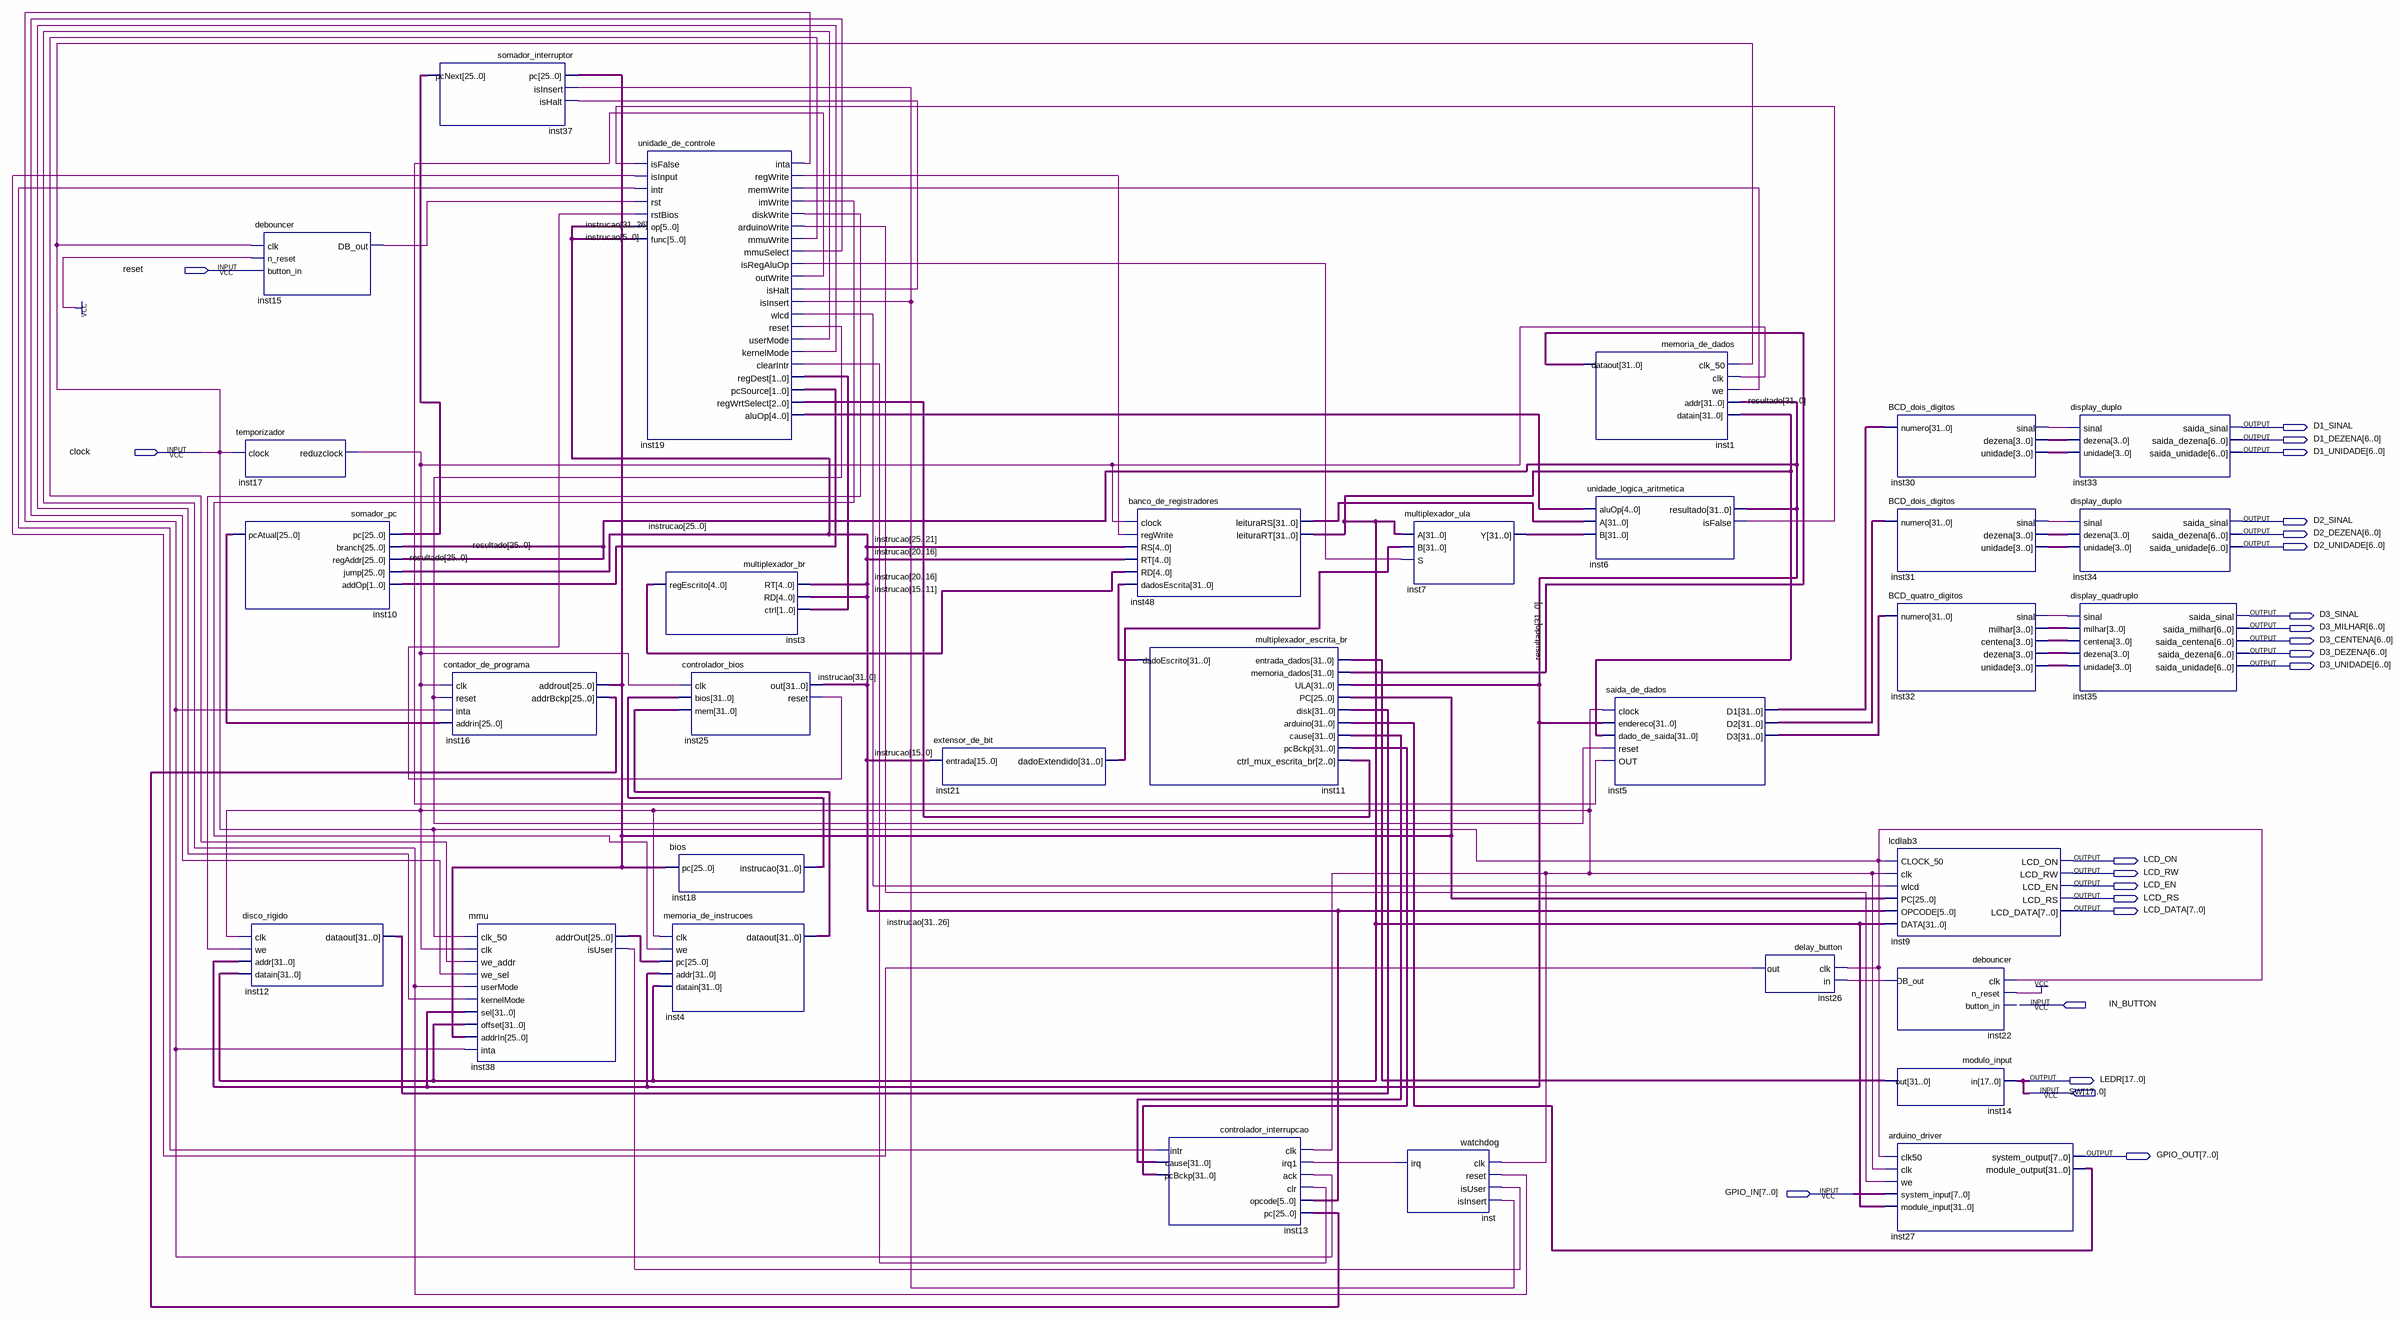
[diagram p0: schematic sheet]
// Quartus schematic iZero.bdf as structural Verilog: 32 symbols, 23 pins
module iZero (
  input  reset,
  input  clock,
  input  IN_BUTTON,
  input  [17:0] SW,
  input  [7:0] GPIO_IN,
  output D1_SINAL,
  output [6:0] D1_DEZENA,
  output [6:0] D1_UNIDADE,
  output D2_SINAL,
  output [6:0] D2_DEZENA,
  output [6:0] D2_UNIDADE,
  output D3_SINAL,
  output [6:0] D3_MILHAR,
  output [6:0] D3_CENTENA,
  output [6:0] D3_DEZENA,
  output [6:0] D3_UNIDADE,
  output LCD_ON,
  output LCD_RW,
  output LCD_EN,
  output LCD_RS,
  output [7:0] LCD_DATA,
  output [17:0] LEDR,
  output [7:0] GPIO_OUT
);

  wire inst6_isfalse, inst13_intr, inst15_db_out, inst17_reduzclock, inst19_arduinowrite, inst19_clearintr,
       inst19_diskwrite, inst19_imwrite, inst19_inta, inst19_ishalt, inst19_isinsert, inst19_isregaluop,
       inst19_kernelmode, inst19_memwrite, inst19_mmuselect, inst19_mmuwrite, inst19_outwrite,
       inst19_regwrite, inst19_reset, inst19_usermode, inst19_wlcd, inst22_db_out, inst25_reset, inst26_out,
       inst30_sinal, inst31_sinal, inst32_sinal, inst38_isuser, inst_irq;
  wire [1:0] inst19_pcsource, inst19_regdest;
  wire [2:0] inst19_regwrtselect;
  wire [3:0] inst30_dezena, inst30_unidade, inst31_dezena, inst31_unidade, inst32_centena, inst32_dezena,
       inst32_milhar, inst32_unidade;
  wire [4:0] inst3_regescrito, inst19_aluop;
  wire [25:0] inst10_pcatual, inst16_addrbckp, inst16_addrout, inst37_pcnext, inst38_addrout;
  wire [31:0] inst1_dataout, inst4_dataout, inst5_d1, inst5_d2, inst5_d3, inst7_y, inst11_dadoescrito,
       inst12_dataout, inst13_cause, inst13_pcbckp, inst14_out, inst18_instrucao, inst21_dadoextendido,
       inst27_module_output, inst48_leiturars, inst48_leiturart, instrucao, resultado;

  debouncer inst15 (.clk(clock), .n_reset(1'b1), .button_in(reset), .DB_out(inst15_db_out));
  temporizador inst17 (.clock(clock), .reduzclock(inst17_reduzclock));
  somador_pc inst10 (
    .pc(inst37_pcnext), .branch(resultado[25:0]), .regAddr(resultado[25:0]), .jump(instrucao[25:0]),
    .addOp(inst19_pcsource), .pcAtual(inst10_pcatual));
  disco_rigido inst12 (
    .clk(inst17_reduzclock), .we(inst19_diskwrite), .addr(resultado), .datain(inst48_leiturart),
    .dataout(inst12_dataout));
  somador_interruptor inst37 (
    .pc(inst16_addrout), .isInsert(inst19_isinsert), .isHalt(inst19_ishalt), .pcNext(inst37_pcnext));
  contador_de_programa inst16 (
    .clk(inst17_reduzclock), .reset(inst19_reset), .inta(inst19_inta), .addrin(inst10_pcatual),
    .addrout(inst16_addrout), .addrBckp(inst16_addrbckp));
  mmu inst38 (
    .clk_50(clock), .clk(inst17_reduzclock), .we_addr(inst19_mmuwrite), .we_sel(inst19_mmuselect),
    .userMode(inst19_usermode), .kernelMode(inst19_kernelmode), .sel(resultado), .offset(inst48_leiturart),
    .addrIn(inst16_addrout), .inta(inst19_inta), .addrOut(inst38_addrout), .isUser(inst38_isuser));
  unidade_de_controle inst19 (
    .isFalse(inst6_isfalse), .isInput(inst26_out), .intr(inst13_intr), .rst(inst15_db_out),
    .rstBios(inst25_reset), .op(instrucao[31:26]), .func(instrucao[5:0]), .inta(inst19_inta),
    .regWrite(inst19_regwrite), .memWrite(inst19_memwrite), .imWrite(inst19_imwrite),
    .diskWrite(inst19_diskwrite), .arduinoWrite(inst19_arduinowrite), .mmuWrite(inst19_mmuwrite),
    .mmuSelect(inst19_mmuselect), .isRegAluOp(inst19_isregaluop), .outWrite(inst19_outwrite),
    .isHalt(inst19_ishalt), .isInsert(inst19_isinsert), .wlcd(inst19_wlcd), .reset(inst19_reset),
    .userMode(inst19_usermode), .kernelMode(inst19_kernelmode), .clearIntr(inst19_clearintr),
    .regDest(inst19_regdest), .pcSource(inst19_pcsource), .regWrtSelect(inst19_regwrtselect),
    .aluOp(inst19_aluop));
  multiplexador_br inst3 (
    .RT(instrucao[20:16]), .RD(instrucao[15:11]), .ctrl(inst19_regdest), .regEscrito(inst3_regescrito));
  controlador_bios inst25 (
    .clk(inst17_reduzclock), .bios(inst18_instrucao), .mem(inst4_dataout), .out(instrucao),
    .reset(inst25_reset));
  bios inst18 (.pc(inst16_addrout), .instrucao(inst18_instrucao));
  memoria_de_instrucoes inst4 (
    .clk(inst17_reduzclock), .we(inst19_imwrite), .pc(inst38_addrout), .addr(resultado),
    .datain(inst48_leiturart), .dataout(inst4_dataout));
  extensor_de_bit inst21 (.entrada(instrucao[15:0]), .dadoExtendido(inst21_dadoextendido));
  banco_de_registradores inst48 (
    .clock(inst17_reduzclock), .regWrite(inst19_regwrite), .RS(instrucao[25:21]), .RT(instrucao[20:16]),
    .RD(inst3_regescrito), .dadosEscrita(inst11_dadoescrito), .leituraRS(inst48_leiturars),
    .leituraRT(inst48_leiturart));
  multiplexador_escrita_br inst11 (
    .entrada_dados(inst14_out), .memoria_dados(inst1_dataout), .ULA(resultado), .PC(inst16_addrout),
    .disk(inst12_dataout), .arduino(inst27_module_output), .cause(inst13_cause), .pcBckp(inst13_pcbckp),
    .ctrl_mux_escrita_br(inst19_regwrtselect), .dadoEscrito(inst11_dadoescrito));
  controlador_interrupcao inst13 (
    .clk(inst17_reduzclock), .irq1(inst_irq), .ack(inst19_inta), .clr(inst19_clearintr),
    .opcode(instrucao[31:26]), .pc(inst16_addrbckp), .intr(inst13_intr), .cause(inst13_cause),
    .pcBckp(inst13_pcbckp));
  multiplexador_ula inst7 (.A(inst48_leiturart), .B(inst21_dadoextendido), .S(inst19_isregaluop), .Y(inst7_y));
  watchdog inst (
    .clk(inst17_reduzclock), .reset(inst19_usermode), .isUser(inst38_isuser), .isInsert(inst19_isinsert),
    .irq(inst_irq));
  memoria_de_dados inst1 (
    .clk_50(clock), .clk(inst17_reduzclock), .we(inst19_memwrite), .addr(resultado),
    .datain(inst48_leiturart), .dataout(inst1_dataout));
  unidade_logica_aritmetica inst6 (
    .aluOp(inst19_aluop), .A(inst48_leiturars), .B(inst7_y), .resultado(resultado), .isFalse(inst6_isfalse));
  saida_de_dados inst5 (
    .clock(inst17_reduzclock), .endereco(resultado), .dado_de_saida(inst48_leiturart), .reset(inst19_reset),
    .OUT(inst19_outwrite), .D1(inst5_d1), .D2(inst5_d2), .D3(inst5_d3));
  delay_button inst26 (.clk(clock), .in(inst22_db_out), .out(inst26_out));
  BCD_dois_digitos inst30 (.numero(inst5_d1), .sinal(inst30_sinal), .dezena(inst30_dezena), .unidade(inst30_unidade));
  BCD_dois_digitos inst31 (.numero(inst5_d2), .sinal(inst31_sinal), .dezena(inst31_dezena), .unidade(inst31_unidade));
  BCD_quatro_digitos inst32 (
    .numero(inst5_d3), .sinal(inst32_sinal), .milhar(inst32_milhar), .centena(inst32_centena),
    .dezena(inst32_dezena), .unidade(inst32_unidade));
  lcdlab3 inst9 (
    .CLOCK_50(clock), .clk(inst17_reduzclock), .wlcd(inst19_wlcd), .PC(inst16_addrout),
    .OPCODE(instrucao[31:26]), .DATA(inst48_leiturart), .LCD_ON(LCD_ON), .LCD_RW(LCD_RW), .LCD_EN(LCD_EN),
    .LCD_RS(LCD_RS), .LCD_DATA(LCD_DATA));
  debouncer inst22 (.clk(clock), .n_reset(1'b1), .button_in(IN_BUTTON), .DB_out(inst22_db_out));
  modulo_input inst14 (.in(SW), .out(inst14_out));
  arduino_driver inst27 (
    .clk50(clock), .clk(inst17_reduzclock), .we(inst19_arduinowrite), .system_input(GPIO_IN),
    .module_input(inst48_leiturart), .system_output(GPIO_OUT), .module_output(inst27_module_output));
  display_duplo inst33 (
    .sinal(inst30_sinal), .dezena(inst30_dezena), .unidade(inst30_unidade), .saida_sinal(D1_SINAL),
    .saida_dezena(D1_DEZENA), .saida_unidade(D1_UNIDADE));
  display_duplo inst34 (
    .sinal(inst31_sinal), .dezena(inst31_dezena), .unidade(inst31_unidade), .saida_sinal(D2_SINAL),
    .saida_dezena(D2_DEZENA), .saida_unidade(D2_UNIDADE));
  display_quadruplo inst35 (
    .sinal(inst32_sinal), .milhar(inst32_milhar), .centena(inst32_centena), .dezena(inst32_dezena),
    .unidade(inst32_unidade), .saida_sinal(D3_SINAL), .saida_milhar(D3_MILHAR), .saida_centena(D3_CENTENA),
    .saida_dezena(D3_DEZENA), .saida_unidade(D3_UNIDADE));

  assign LEDR = SW;
endmodule
